# Altium schematic sheet [06] Connectors.SchDoc: Connectors
size Letter; Revision: 1.0; PageSetup: Record=PageOptions|CenterHorizontal=True|CenterVertical=True|PrintScale=1.00|XCorrection=1.00|YCorrection=1.00|PrintKind=1|BorderSize=5000000|LeftOffset=0|BottomOffset=0|Orientation=2|PaperLength=1000|PaperWidth=1000|Scale=100|PaperSource=7|PrintQuality=-3|MediaType=1|DitherType=10|PrintScaleMode=1|PaperKind=Letter|PaperIndex=1; ProjectTitle: Data Acquisition System
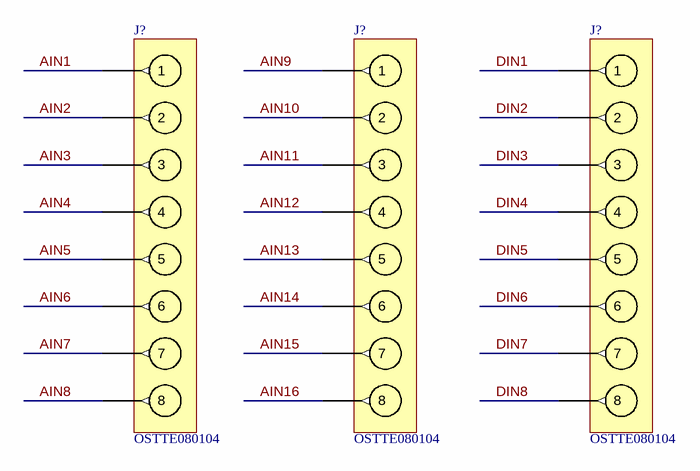
[diagram p0: [06] Connectors.SchDoc]

## Parts
(Parts that share a designator on the sheet are numbered #1, #2 ... from top to bottom, then left to right.)
J?#1  OSTTE080104  [OSTTE0801x4]
J?#2  OSTTE080104  [OSTTE0801x4]
J?#3  OSTTE080104  [OSTTE0801x4]

## Nets
AIN1: J?#1.1
AIN2: J?#1.2
AIN3: J?#1.3
AIN4: J?#1.4
AIN5: J?#1.5
AIN6: J?#1.6
AIN7: J?#1.7
AIN8: J?#1.8
AIN9: J?#2.1
AIN10: J?#2.2
AIN11: J?#2.3
AIN12: J?#2.4
AIN13: J?#2.5
AIN14: J?#2.6
AIN15: J?#2.7
AIN16: J?#2.8
DIN1: J?#3.1
DIN2: J?#3.2
DIN3: J?#3.3
DIN4: J?#3.4
DIN5: J?#3.5
DIN6: J?#3.6
DIN7: J?#3.7
DIN8: J?#3.8

## Notes on the sheet
- Date:
- Revision:
- Sheet
- of

## Library data of the parts
J?#1-J?#3 = OSTTE0801x4: Terminal Block 8-pos; Supplier 1: Digi-Key; Supplier Part Number 1: ED2746-ND